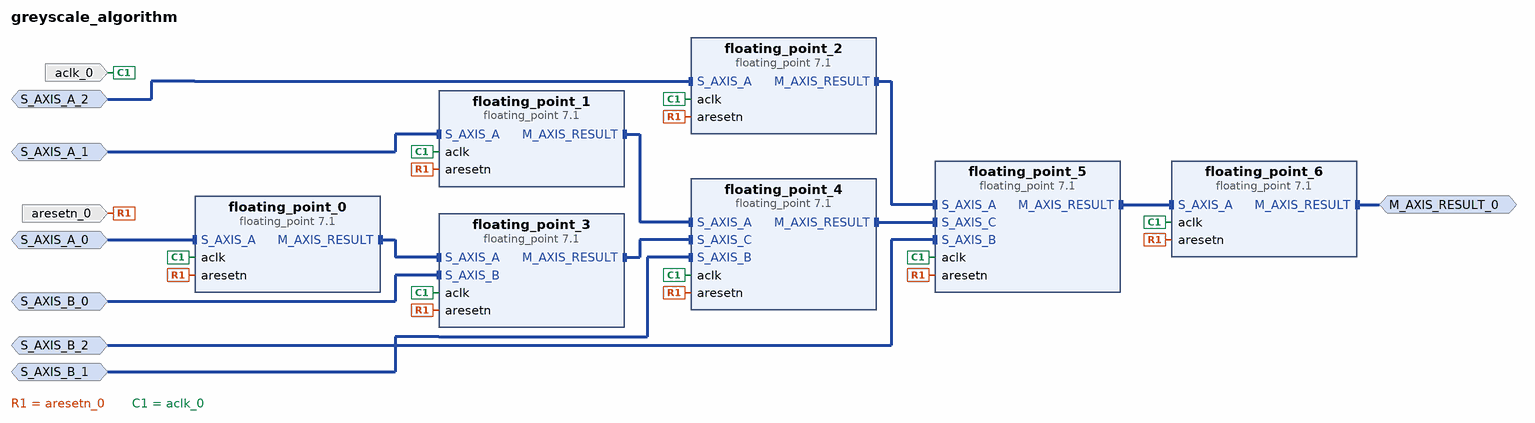
[diagram p0: block diagram of the top level]
# Vivado block design greyscale_algorithm, xc7a50tcsg324-1, Vivado 2019.2
create_bd_design greyscale_algorithm

create_bd_intf_port -mode Slave -vlnv xilinx.com:interface:axis_rtl:1.0 S_AXIS_B_0
set_property -dict [list \
  CONFIG.TDATA_NUM_BYTES 4 \
  CONFIG.TDEST_WIDTH 0 \
  CONFIG.TID_WIDTH 0 \
  CONFIG.TUSER_WIDTH 0 \
  CONFIG.HAS_TREADY 1 \
  CONFIG.HAS_TSTRB 0 \
  CONFIG.HAS_TKEEP 0 \
  CONFIG.HAS_TLAST 0 \
  CONFIG.FREQ_HZ 10000000 \
  CONFIG.LAYERED_METADATA undef \
] [get_bd_intf_ports S_AXIS_B_0]
create_bd_intf_port -mode Slave -vlnv xilinx.com:interface:axis_rtl:1.0 S_AXIS_B_1
set_property -dict [list \
  CONFIG.TDATA_NUM_BYTES 4 \
  CONFIG.TDEST_WIDTH 0 \
  CONFIG.TID_WIDTH 0 \
  CONFIG.TUSER_WIDTH 0 \
  CONFIG.HAS_TREADY 1 \
  CONFIG.HAS_TSTRB 0 \
  CONFIG.HAS_TKEEP 0 \
  CONFIG.HAS_TLAST 0 \
  CONFIG.FREQ_HZ 10000000 \
  CONFIG.LAYERED_METADATA undef \
] [get_bd_intf_ports S_AXIS_B_1]
create_bd_intf_port -mode Slave -vlnv xilinx.com:interface:axis_rtl:1.0 S_AXIS_B_2
set_property -dict [list \
  CONFIG.TDATA_NUM_BYTES 4 \
  CONFIG.TDEST_WIDTH 0 \
  CONFIG.TID_WIDTH 0 \
  CONFIG.TUSER_WIDTH 0 \
  CONFIG.HAS_TREADY 1 \
  CONFIG.HAS_TSTRB 0 \
  CONFIG.HAS_TKEEP 0 \
  CONFIG.HAS_TLAST 0 \
  CONFIG.FREQ_HZ 10000000 \
  CONFIG.LAYERED_METADATA undef \
] [get_bd_intf_ports S_AXIS_B_2]
create_bd_intf_port -mode Slave -vlnv xilinx.com:interface:axis_rtl:1.0 S_AXIS_A_0
set_property -dict [list \
  CONFIG.TDATA_NUM_BYTES 4 \
  CONFIG.TDEST_WIDTH 0 \
  CONFIG.TID_WIDTH 0 \
  CONFIG.TUSER_WIDTH 0 \
  CONFIG.HAS_TREADY 1 \
  CONFIG.HAS_TSTRB 0 \
  CONFIG.HAS_TKEEP 0 \
  CONFIG.HAS_TLAST 0 \
  CONFIG.FREQ_HZ 10000000 \
  CONFIG.LAYERED_METADATA undef \
] [get_bd_intf_ports S_AXIS_A_0]
create_bd_intf_port -mode Slave -vlnv xilinx.com:interface:axis_rtl:1.0 S_AXIS_A_1
set_property -dict [list \
  CONFIG.TDATA_NUM_BYTES 4 \
  CONFIG.TDEST_WIDTH 0 \
  CONFIG.TID_WIDTH 0 \
  CONFIG.TUSER_WIDTH 0 \
  CONFIG.HAS_TREADY 1 \
  CONFIG.HAS_TSTRB 0 \
  CONFIG.HAS_TKEEP 0 \
  CONFIG.HAS_TLAST 0 \
  CONFIG.FREQ_HZ 10000000 \
  CONFIG.LAYERED_METADATA undef \
] [get_bd_intf_ports S_AXIS_A_1]
create_bd_intf_port -mode Slave -vlnv xilinx.com:interface:axis_rtl:1.0 S_AXIS_A_2
set_property -dict [list \
  CONFIG.TDATA_NUM_BYTES 4 \
  CONFIG.TDEST_WIDTH 0 \
  CONFIG.TID_WIDTH 0 \
  CONFIG.TUSER_WIDTH 0 \
  CONFIG.HAS_TREADY 1 \
  CONFIG.HAS_TSTRB 0 \
  CONFIG.HAS_TKEEP 0 \
  CONFIG.HAS_TLAST 0 \
  CONFIG.FREQ_HZ 10000000 \
  CONFIG.LAYERED_METADATA undef \
] [get_bd_intf_ports S_AXIS_A_2]
create_bd_intf_port -mode Master -vlnv xilinx.com:interface:axis_rtl:1.0 M_AXIS_RESULT_0
set_property -dict {CONFIG.FREQ_HZ 10000000} [get_bd_intf_ports M_AXIS_RESULT_0]
create_bd_port -dir I -type rst aresetn_0
create_bd_port -dir I -type clk aclk_0
set_property -dict {CONFIG.FREQ_HZ 10000000} [get_bd_ports aclk_0]

create_bd_cell -type ip -vlnv xilinx.com:ip:floating_point:7.1 floating_point_0
set_property -dict [list \
  CONFIG.C_Accum_Input_Msb 32 \
  CONFIG.C_Accum_Lsb -31 \
  CONFIG.C_Accum_Msb 32 \
  CONFIG.C_Latency 7 \
  CONFIG.C_Mult_Usage No_Usage \
  CONFIG.C_Rate 1 \
  CONFIG.C_Result_Exponent_Width 8 \
  CONFIG.C_Result_Fraction_Width 24 \
  CONFIG.Flow_Control Blocking \
  CONFIG.Has_ARESETn true \
  CONFIG.Has_RESULT_TREADY true \
  CONFIG.Maximum_Latency false \
  CONFIG.Operation_Type Fixed_to_float \
  CONFIG.Result_Precision_Type Single \
] [get_bd_cells floating_point_0]
create_bd_cell -type ip -vlnv xilinx.com:ip:floating_point:7.1 floating_point_1
set_property -dict [list \
  CONFIG.C_Accum_Input_Msb 32 \
  CONFIG.C_Accum_Lsb -31 \
  CONFIG.C_Accum_Msb 32 \
  CONFIG.C_Latency 7 \
  CONFIG.C_Mult_Usage No_Usage \
  CONFIG.C_Rate 1 \
  CONFIG.C_Result_Exponent_Width 8 \
  CONFIG.C_Result_Fraction_Width 24 \
  CONFIG.Flow_Control Blocking \
  CONFIG.Has_ARESETn true \
  CONFIG.Has_RESULT_TREADY true \
  CONFIG.Maximum_Latency false \
  CONFIG.Operation_Type Fixed_to_float \
  CONFIG.Result_Precision_Type Single \
] [get_bd_cells floating_point_1]
create_bd_cell -type ip -vlnv xilinx.com:ip:floating_point:7.1 floating_point_2
set_property -dict [list \
  CONFIG.C_Accum_Input_Msb 32 \
  CONFIG.C_Accum_Lsb -31 \
  CONFIG.C_Accum_Msb 32 \
  CONFIG.C_Latency 7 \
  CONFIG.C_Mult_Usage No_Usage \
  CONFIG.C_Rate 1 \
  CONFIG.C_Result_Exponent_Width 8 \
  CONFIG.C_Result_Fraction_Width 24 \
  CONFIG.Flow_Control Blocking \
  CONFIG.Has_ARESETn true \
  CONFIG.Has_RESULT_TREADY true \
  CONFIG.Maximum_Latency false \
  CONFIG.Operation_Type Fixed_to_float \
  CONFIG.Result_Precision_Type Single \
] [get_bd_cells floating_point_2]
create_bd_cell -type ip -vlnv xilinx.com:ip:floating_point:7.1 floating_point_3
set_property -dict [list \
  CONFIG.C_Latency 1 \
  CONFIG.C_Mult_Usage Full_Usage \
  CONFIG.C_Rate 1 \
  CONFIG.C_Result_Exponent_Width 8 \
  CONFIG.C_Result_Fraction_Width 24 \
  CONFIG.Has_ARESETn true \
  CONFIG.Maximum_Latency false \
  CONFIG.Operation_Type Multiply \
  CONFIG.Result_Precision_Type Single \
] [get_bd_cells floating_point_3]
create_bd_cell -type ip -vlnv xilinx.com:ip:floating_point:7.1 floating_point_4
set_property -dict [list \
  CONFIG.Add_Sub_Value Add \
  CONFIG.C_Latency 1 \
  CONFIG.C_Mult_Usage Medium_Usage \
  CONFIG.C_Rate 1 \
  CONFIG.C_Result_Exponent_Width 8 \
  CONFIG.C_Result_Fraction_Width 24 \
  CONFIG.Has_ARESETn true \
  CONFIG.Maximum_Latency false \
  CONFIG.Operation_Type FMA \
  CONFIG.Result_Precision_Type Single \
] [get_bd_cells floating_point_4]
create_bd_cell -type ip -vlnv xilinx.com:ip:floating_point:7.1 floating_point_5
set_property -dict [list \
  CONFIG.Add_Sub_Value Add \
  CONFIG.C_Latency 1 \
  CONFIG.C_Mult_Usage Medium_Usage \
  CONFIG.C_Rate 1 \
  CONFIG.C_Result_Exponent_Width 8 \
  CONFIG.C_Result_Fraction_Width 24 \
  CONFIG.Has_ARESETn true \
  CONFIG.Maximum_Latency false \
  CONFIG.Operation_Type FMA \
  CONFIG.Result_Precision_Type Single \
] [get_bd_cells floating_point_5]
create_bd_cell -type ip -vlnv xilinx.com:ip:floating_point:7.1 floating_point_6
set_property -dict [list \
  CONFIG.C_Latency 1 \
  CONFIG.C_Mult_Usage No_Usage \
  CONFIG.C_Rate 1 \
  CONFIG.C_Result_Exponent_Width 32 \
  CONFIG.C_Result_Fraction_Width 0 \
  CONFIG.Has_ARESETn true \
  CONFIG.Maximum_Latency false \
  CONFIG.Operation_Type Float_to_fixed \
  CONFIG.Result_Precision_Type Int32 \
] [get_bd_cells floating_point_6]

# ---- connections ----

connect_bd_intf_net [get_bd_intf_pins floating_point_6/S_AXIS_A] [get_bd_intf_pins floating_point_5/M_AXIS_RESULT]
connect_bd_intf_net -intf_net S_AXIS_B_2_1 [get_bd_intf_ports S_AXIS_B_2] [get_bd_intf_pins floating_point_5/S_AXIS_B]
connect_bd_intf_net [get_bd_intf_pins floating_point_1/M_AXIS_RESULT] [get_bd_intf_pins floating_point_4/S_AXIS_A]
connect_bd_intf_net -intf_net S_AXIS_B_1_1 [get_bd_intf_ports S_AXIS_B_1] [get_bd_intf_pins floating_point_4/S_AXIS_B]
connect_bd_intf_net [get_bd_intf_pins floating_point_4/M_AXIS_RESULT] [get_bd_intf_pins floating_point_5/S_AXIS_C]
connect_bd_intf_net [get_bd_intf_pins floating_point_2/M_AXIS_RESULT] [get_bd_intf_pins floating_point_5/S_AXIS_A]
connect_bd_intf_net -intf_net S_AXIS_A_2_1 [get_bd_intf_ports S_AXIS_A_2] [get_bd_intf_pins floating_point_2/S_AXIS_A]
connect_bd_intf_net [get_bd_intf_pins floating_point_0/M_AXIS_RESULT] [get_bd_intf_pins floating_point_3/S_AXIS_A]
connect_bd_intf_net -intf_net S_AXIS_A_0_1 [get_bd_intf_ports S_AXIS_A_0] [get_bd_intf_pins floating_point_0/S_AXIS_A]
connect_bd_intf_net [get_bd_intf_pins floating_point_3/M_AXIS_RESULT] [get_bd_intf_pins floating_point_4/S_AXIS_C]
connect_bd_intf_net -intf_net S_AXIS_A_1_1 [get_bd_intf_ports S_AXIS_A_1] [get_bd_intf_pins floating_point_1/S_AXIS_A]
connect_bd_intf_net -intf_net S_AXIS_B_0_1 [get_bd_intf_ports S_AXIS_B_0] [get_bd_intf_pins floating_point_3/S_AXIS_B]
connect_bd_intf_net [get_bd_intf_ports M_AXIS_RESULT_0] [get_bd_intf_pins floating_point_6/M_AXIS_RESULT]
connect_bd_net -net aresetn_0_1 [get_bd_ports aresetn_0] \
  [get_bd_pins floating_point_2/aresetn] [get_bd_pins floating_point_5/aresetn] [get_bd_pins floating_point_4/aresetn] \
  [get_bd_pins floating_point_3/aresetn] [get_bd_pins floating_point_0/aresetn] [get_bd_pins floating_point_1/aresetn] \
  [get_bd_pins floating_point_6/aresetn]
connect_bd_net -net aclk_0_1 [get_bd_ports aclk_0] \
  [get_bd_pins floating_point_2/aclk] [get_bd_pins floating_point_5/aclk] [get_bd_pins floating_point_4/aclk] \
  [get_bd_pins floating_point_3/aclk] [get_bd_pins floating_point_0/aclk] [get_bd_pins floating_point_1/aclk] \
  [get_bd_pins floating_point_6/aclk]

validate_bd_design
save_bd_design
